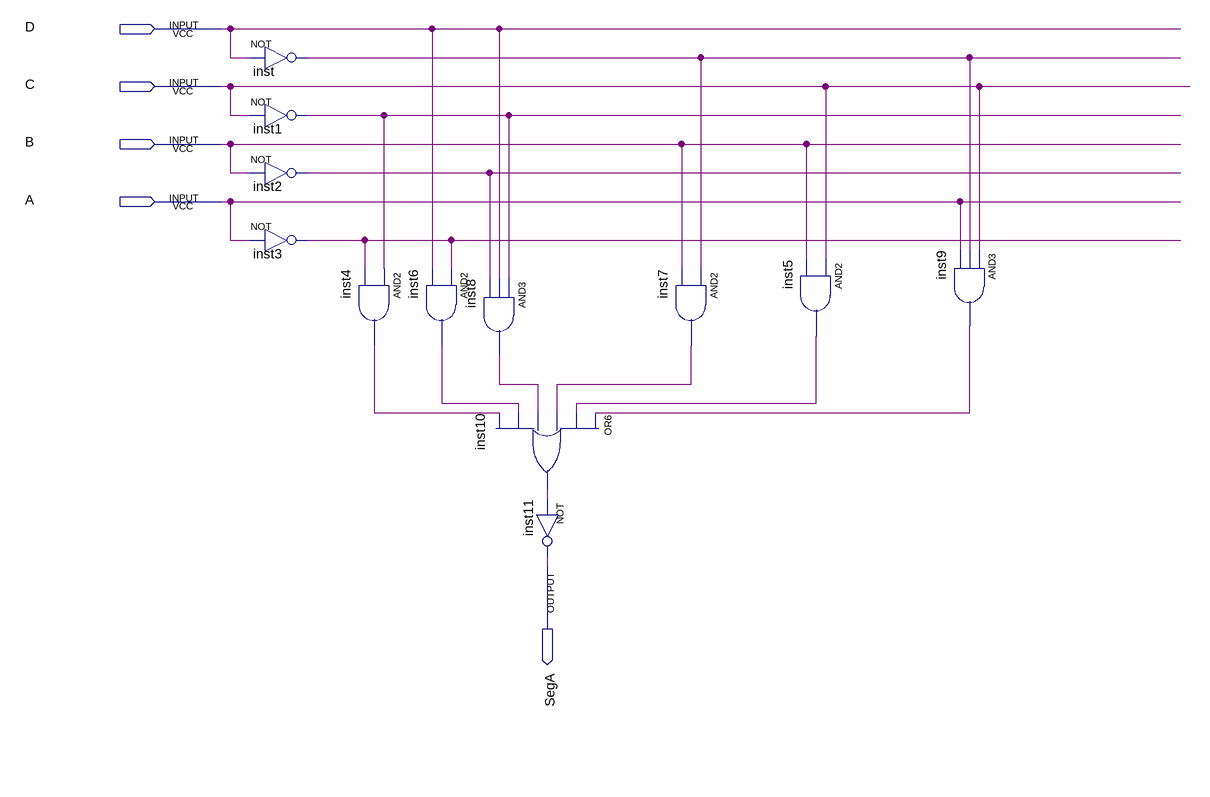
[diagram p0: schematic sheet]
// Quartus schematic SegA.bdf as structural Verilog: 12 symbols, 5 pins
module SegA (
  input  D,
  input  C,
  input  B,
  input  A,
  output SegA
);

  wire inst1_out, inst2_out, inst3_out, inst4_out, inst5_out, inst6_out, inst7_out, inst8_out, inst9_out,
       inst10_out, inst_out;

  not inst (inst_out, D);
  not inst1 (inst1_out, C);
  not inst2 (inst2_out, B);
  not inst3 (inst3_out, A);
  and inst4 (inst4_out, inst1_out, inst3_out);
  and inst6 (inst6_out, inst3_out, D);
  and inst8 (inst8_out, inst1_out, D, inst2_out);
  or inst10 (inst10_out, inst9_out, inst5_out, inst7_out, inst8_out, inst6_out, inst4_out);
  not inst11 (SegA, inst10_out);
  and inst7 (inst7_out, inst_out, B);
  and inst5 (inst5_out, C, B);
  and inst9 (inst9_out, C, inst_out, A);
endmodule
